# Altium schematic sheet D5035-03.SchDoc: Sheet Description
size A3; Organization: Organization; Address1: Address1; Address2: Address2; Address3: Address3; Address4: Address4; DocumentNumber: 1; Revision: 0; SheetNumber: 1; SheetTotal: 5; PageSetup: Record=PageOptions|CenterHorizontal=True|CenterVertical=True|PrintScale=1.00|XCorrection=1.00|YCorrection=1.00|PrintKind=1|BorderSize=5000000|LeftOffset=0|BottomOffset=0|Orientation=2|PaperLength=1000|PaperWidth=1000|Scale=100|PaperSource=7|PrintQuality=-4|MediaType=1|DitherType=10|PaperKind=A3|PrintScaleMode=0
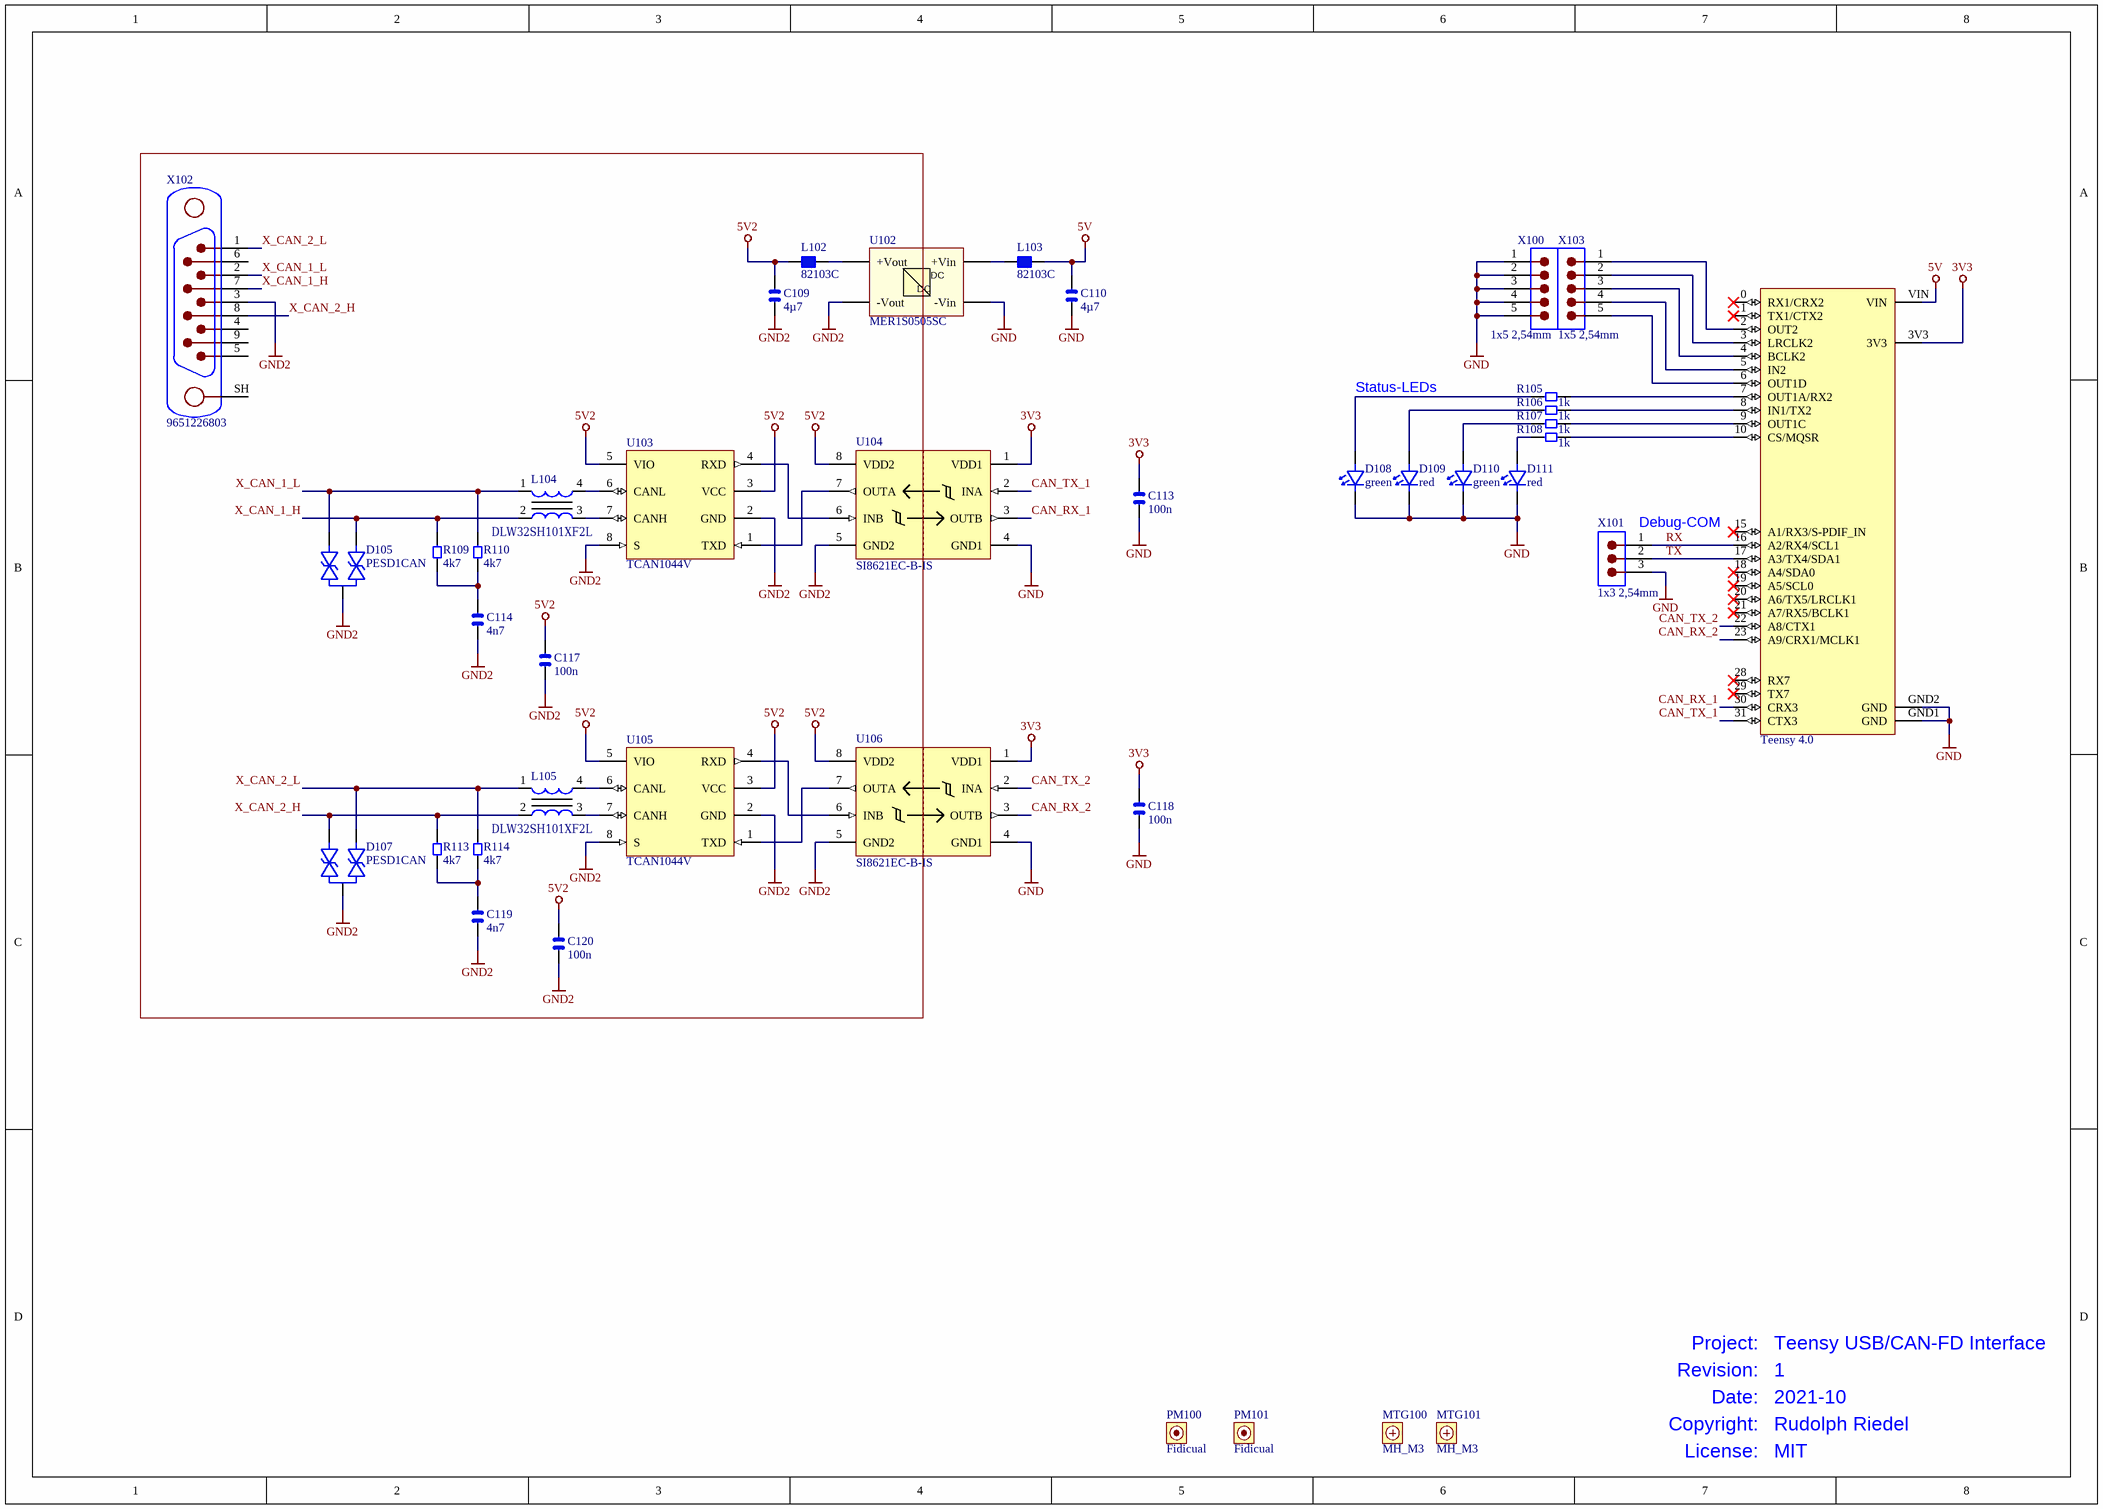
[diagram p0: D5035-03.SchDoc]

## Parts
C109  4µ7  [CAPC2012X14L]
C110  4µ7  [CAPC2012X14L]
C113  100n  [CAPC1608X09L]
C114  4n7  [CAPC2012X14L]
C117  100n  [CAPC1608X09L]
C118  100n  [CAPC1608X09L]
C119  4n7  [CAPC2012X14L]
C120  100n  [CAPC1608X09L]
D105  PESD1CAN  [SOT95P280X110-3N]
D107  PESD1CAN  [SOT95P280X110-3N]
D108  green  [DIOC1608X06N_LED]
D109  red  [DIOC1608X06N_LED]
D110  green  [DIOC1608X06N_LED]
D111  red  [DIOC1608X06N_LED]
L102  82103C  [Murata_8200C]
L103  82103C  [Murata_8200C]
L104  DLW32SH101XF2L‎  [ACT1210]
L105  DLW32SH101XF2L‎  [ACT1210]
MTG100  MH_M3  [HOLE_3_2MM]  (no BOM)
MTG101  MH_M3  [HOLE_3_2MM]  (no BOM)
PM100  Fidicual  [PM100]  (no BOM)
PM101  Fidicual  [PM100]  (no BOM)
R105  1k  [RESC1608X06L]
R106  1k  [RESC1608X06L]
R107  1k  [RESC1608X06L]
R108  1k  [RESC1608X06L]
R109  4k7  [RESC2012X06L]
R110  4k7  [RESC2012X06L]
R113  4k7  [RESC2012X06L]
R114  4k7  [RESC2012X06L]
Teensy_4.0  Teensy_4_0_minimal  [Teensy_4_0_minimal]  (value not drawn)
U102  MER1S0505SC  [MER1SxxxxC]
U103  TCAN1044V  [SOT65P280X100-8N]
U104  SI8621EC-B-IS  [SOIC127P600X175-8N]
U105  TCAN1044V  [SOT65P280X100-8N]
U106  SI8621EC-B-IS  [SOIC127P600X175-8N]
X100  1x5 2,54mm  [PAD_1x05_2_54mm]
X101  1x3 2,54mm  [PINH_1x03_2_54mm]
X102  9651226803  [09651226803]
X103  1x5 2,54mm  [PAD_1x05_2_54mm]

## Nets
3V3: C113.2 C118.2 Teensy_4.0.3V3 U104.1(VDD1) U106.1(VDD1)
5V: C110.2 L103.1 Teensy_4.0.VIN
5V2: C109.2 C117.2 C120.2 L102.2 U103.3(VCC) U103.5(VIO) U104.8(VDD2) U105.3(VCC) U105.5(VIO) U106.8(VDD2)
GND: C110.1 C113.1 C118.1 D108.1 D109.1 D110.1 D111.1 Teensy_4.0.GND1(GND) Teensy_4.0.GND2(GND) U102.2(-Vin) U104.4(GND1) U106.4(GND1) X100.1 X100.2 X100.3 X100.4 X100.5 X101.3
GND2: C109.1 C114.1 C117.1 C119.1 C120.1 D105.3 D107.3 U102.4(-Vout) U103.2(GND) U103.8(S) U104.5(GND2) U105.2(GND) U105.8(S) U106.5(GND2) X102.3
CAN_RX_1: Teensy_4.0.30(CRX3) U104.3(OUTB)
CAN_RX_2: Teensy_4.0.23(A9/CRX1/MCLK1) U106.3(OUTB)
CAN_TX_1: Teensy_4.0.31(CTX3) U104.2(INA)
CAN_TX_2: Teensy_4.0.22(A8/CTX1) U106.2(INA)
RX: Teensy_4.0.16(A2/RX4/SCL1) X101.1
TX: Teensy_4.0.17(A3/TX4/SDA1) X101.2
X_CAN_1_H: D105.2 L104.2 R109.2 X102.7
X_CAN_1_L: D105.1 L104.1 R110.2 X102.2
X_CAN_2_H: D107.1 L105.2 R113.2 X102.8
X_CAN_2_L: D107.2 L105.1 R114.2 X102.1
NetC114_2: C114.2 R109.1 R110.1
NetC119_2: C119.2 R113.1 R114.1
NetD108_2: D108.2 R105.1
NetD109_2: D109.2 R106.1
NetD110_2: D110.2 R107.1
NetD111_2: D111.2 R108.1
NetL102_1: L102.1 U102.6(+Vout)
NetL103_2: L103.2 U102.1(+Vin)
NetL104_3: L104.3 U103.7(CANH)
NetL104_4: L104.4 U103.6(CANL)
NetL105_3: L105.3 U105.7(CANH)
NetL105_4: L105.4 U105.6(CANL)
NetR105_2: R105.2 Teensy_4.0.7(OUT1A/RX2)
NetR106_2: R106.2 Teensy_4.0.8(IN1/TX2)
NetR107_2: R107.2 Teensy_4.0.9(OUT1C)
NetR108_2: R108.2 Teensy_4.0.10(CS/MQSR)
NetTeensy_4.0_2: Teensy_4.0.2(OUT2) X103.1
NetTeensy_4.0_3: Teensy_4.0.3(LRCLK2) X103.2
NetTeensy_4.0_4: Teensy_4.0.4(BCLK2) X103.3
NetTeensy_4.0_5: Teensy_4.0.5(IN2) X103.4
NetTeensy_4.0_6: Teensy_4.0.6(OUT1D) X103.5
NetU103_1: U103.1(TXD) U104.7(OUTA)
NetU103_4: U103.4(RXD) U104.6(INB)
NetU105_1: U105.1(TXD) U106.7(OUTA)
NetU105_4: U105.4(RXD) U106.6(INB)

Not connected (* = marked no-connect by the designer): Teensy_4.0 0(RX1/CRX2)* 1(TX1/CTX2)* 15(A1/RX3/S-PDIF_IN)* 18(A4/SDA0)* 19(A5/SCL0)* 20(A6/TX5/LRCLK1)* 21(A7/RX5/BCLK1)* 28(RX7)* 29(TX7)*; X102 4 5 6 9 SH

## Notes on the sheet
- Status-LEDs
- (near X101) Debug-COM
- Project:
- Revision:
- Teensy USB/CAN-FD Interface
- 1
- Date:
- Copyright:
- License:
- 2021-10
- Rudolph Riedel
- MIT
- A3_base_en_02.005
- Title:
- PCBA:
- Project Leader:
- Schematic State:
- IAV-PCBA:
- Cust.PCBA:
- IAV-
- -
- Editor:
- Variant:
- Variant State:
- Edited:
- Printed:
- Document:
- ©
- File:
- Page:
- of
- (in symbol MER1S0505SC) DC

## Library data of the parts
C109 C110 C114 C119 = CAPC_0805: 0805 Chip Capacitor; Editor: rriedel; Kategorie: generic; Unterart: unpolarized; Part Number: CAPC_0805; Status: tested; Bauteilart: Capacitor; PackageDescription: 0805
  C109 C110: Value: 4µ7
  C114 C119: Value: 4n7
C113 C117 C118 C120 = CAPC_0603: 0603 Chip Capacitor; Editor: rriedel; Kategorie: generic; Unterart: unpolarized; Part Number: CAPC_0603; Value: 100n; Status: tested; Bauteilart: Capacitor; PackageDescription: 0603
D105 D107 = PESD1CAN: CAN bus ESD protection diode; Manufacturer: Nexperia; Editor: rriedel; Kategorie: Part; Unterart: Transil; Part Number: PESD1CAN; Value: PESD1CAN; Status: new; Date: 27.06.2020; Bauteilart: Diode; PackageDescription: SOT23; Part_Number_1: PESD1CAN; Distributor_1: Digi-Key; Distributor_1_Part_Number: 1727-3817-1-ND
D108-D111 = LED_0603: LED, 0603; Editor: rriedel; Kategorie: generic; Bauteilart: Diode; Part Number: LED_0603; Status: new; Date: 29.06.2020; Unterart: generic; PackageDescription: 0603
  D108 D110: Value: green
  D109 D111: Value: red
L102 L103 = 82103C: 10µH, 0,5A, 400mR; Manufacturer: Murata; Editor: rriedel; Kategorie: Part; Bauteilart: Inductor; Unterart: Power; Part Number: 82103C; Value: 82103C; Status: new; Date: 27.06.2020; PackageDescription: 3,2x2,5 mm; Part_Number_1: 82103C; Distributor_1: Digi-Key; Distributor_1_Part_Number: 811-2473-1-ND
L104 L105 = ACT1210-101-2P-TL00: Common Mode Filter,  -50°C ... +150°C, AEC-Q200; Manufacturer: TDK; Editor: rriedel; Kategorie: Part; Bauteilart: Inductor; Part Number: ACT1210-101-2P-TL00; Value: DLW32SH101XF2L‎; Status: tested; Date: 17.10.2017; Unterart: Filter; PackageDescription: 3225; Part_Number_1: ACT1210-101-2P-TL00; Distributor_1: Farnell; Distributor_1_Part_Number: 2442838; Distributor_2: Digi-Key; Distributor_2_Part_Number: 445-172386-1-ND
MTG100 MTG101 = MH_M3: Mounting-Hole for M3 screws; Editor: rriedel; Kategorie: No_Bom; Bauteilart: Mechanic; Unterart: Holes; Part Number: MH_M3; Value: MH_M3; Status: tested; Date: 13.05.2018
PM100 PM101 = PM100: Passermarke für Bestueckungsautomaten 1mm rund, 2,2mm quadratischer Ausschnitt, 2,1 mm Ausstellung Loetstoplack; Editor: rriedel; Kategorie: No_Bom; Bauteilart: Manufacturing; Part Number: PM100; Value: Fidicual; Status: tested; Date: 22.02.2017; Unterart: Passermarke; PackageDescription: Passermarke 1.0mm rund
R105-R108 = RESC_0603: 0603 Chip Resistor; Editor: rriedel; Kategorie: generic; Part Number: RESC_0603; Value: 1k; Status: tested; Bauteilart: Resistor; Unterart: generic; PackageDescription: 0603
R109 R110 R113 R114 = RESC_0805: 0805 Chip Resistor; Editor: rriedel; Kategorie: generic; Part Number: RESC_0805; Value: 4k7; Status: tested; Bauteilart: Resistor; Unterart: generic; PackageDescription: 0805
U102 = MER1S0505SC: Isolated 1W Single Output DC-DC Converters 5V/5V 200mA; Manufacturer: Murata; Editor: rriedel; Kategorie: Part; Bauteilart: Module; Unterart: DCDC; Part Number: MER1S0505SC; Value: MER1S0505SC; Status: new; Date: 27.06.2020; PackageDescription: 4Pin SIP; Part_Number_1: MER1S0505SC; Distributor_1: Digi-Key; Distributor_1_Part_Number: 811-2124-5-ND‎
U103 U105 = TCAN1044V: CAN-FD transceiver 8MBit, VIO Pin; Manufacturer: TI; Part_Number_1: TCAN1044VDDFR; Editor: rriedel; Kategorie: Part; Bauteilart: IC; Unterart: CAN; Part Number: TCAN1044V; Value: TCAN1044V; Status: new; Date: 28.06.2020; PackageDescription: SOT23-8; Distributor_1: Digi-Key; Distributor_1_Part_Number: 296-TCAN1044VDDFRCT-ND
U104 U106 = SI8621EC-B-IS: Dual channel digital isolator, 150Mbit, 3,75kV; Manufacturer: Silicon Labs; Editor: rriedel; Kategorie: Part; Bauteilart: IC; Part Number: SI8621EC-B-IS; Value: SI8621EC-B-IS; Status: new; Date: 29.06.2020; Unterart: Isolator; PackageDescription: SO8; Part_Number_1: SI8621EC-B-IS; Distributor_1: Digi-Key; Distributor_1_Part_Number: 336-4776-1-ND
X100 X103 = PINH_1x5_2_54: Pin-Header 2,54 mm 5pins; Editor: rriedel; Kategorie: generic; Bauteilart: Connector; Part Number: PINH_1x5_2_54; Value: 1x5 2,54mm; Status: tested; Date: 20.06.2017; Unterart: Pin-Header
X101 = PINH_1x3_2_54: Pin-Header 2,54 mm 3pins; Editor: rriedel; Kategorie: generic; Bauteilart: Connector; Part Number: PINH_1x3_2_54; Value: 1x3 2,54mm; Status: tested; Date: 02.02.2017; Unterart: Pin-Header
X102 = 9651226803: D-Sub, 9 pin, male, right angle; Manufacturer: Harting; Editor: rriedel; Kategorie: Part; Bauteilart: Connector; Part Number: 9651226803; Value: 9651226803; Status: new; Date: 29.06.2020; Unterart: D-Sub; PackageDescription: D-Sub; Part_Number_1: 9651226803; Distributor_1: Farnell; Distributor_1_Part_Number: 2752007